# EAGLE schematic Placa_Power_ESP_sch (EAGLE 9.7.0)
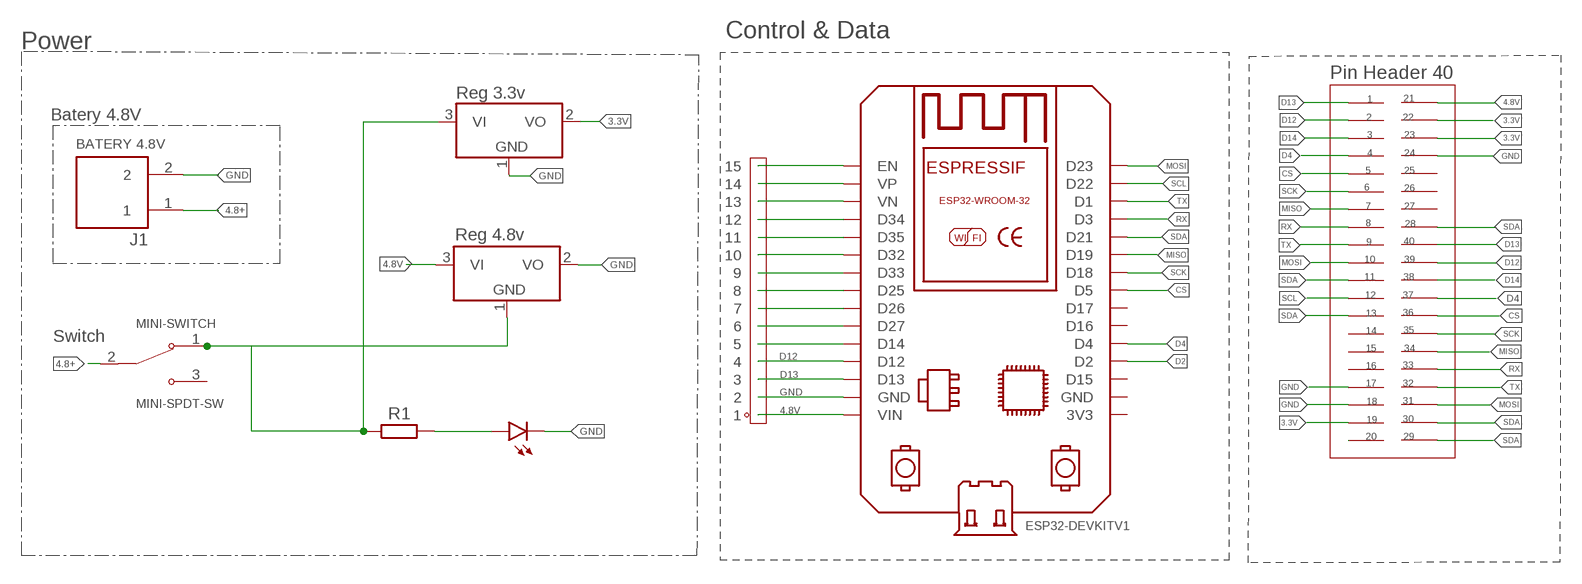
[diagram p0: schematic, sheet 1]

## Parts
D1  LED  LED_RADIALYELLOW  [LEDRD254W60D565H860B_Y]
ESP32DEVKIT  ESP32DEVKITV1SHRIDATTDUDHAT  [ESP32-DEVKITV1]
IC2  LM7805-5V  LD1117_TO220  [TO220V]
J1  BATERY 4.8V  KF301-2P  [HANDSON_KF301-2P]
LM1117-3.3V  LM1117-3.3  LD1117_TO220  [TO220V]
MINI-SWITCH  MINI-SPDT-SW  [SW_MINI-SPDT-SW-BACKUP]
R1  R_AXIAL-7.2MM-PITCH  [RESAD724W46L381D178B]
U$1  PIN_1X15  [PIN_1X15]
U$3  PINHEADER  [PINHEADER]

## Nets
3.3V: LM1117-3.3V.2(VO) U$3.19 U$3.22 U$3.23
4.8+: J1.1 MINI-SWITCH.2
4.8V: ESP32DEVKIT.VIN IC2.3(VI) U$1.1 U$3.20 U$3.21
CS: ESP32DEVKIT.D5 U$3.5 U$3.36
D2: ESP32DEVKIT.D2
D4: ESP32DEVKIT.D4 U$3.4 U$3.37
D12: ESP32DEVKIT.D12 U$1.4 U$3.2 U$3.39
D13: ESP32DEVKIT.D13 U$1.3 U$3.1 U$3.40
D14: ESP32DEVKIT.D14 U$1.5 U$3.3 U$3.38
GND: D1.C ESP32DEVKIT.GND IC2.2(VO) J1.2 LM1117-3.3V.1(GND) U$1.2 U$3.17 U$3.18 U$3.24
MISO: ESP32DEVKIT.D19 U$3.7 U$3.34
MOSI: ESP32DEVKIT.D23 U$3.10 U$3.31
N$2: D1.A R1.2
N$3: ESP32DEVKIT.EN U$1.15
N$4: ESP32DEVKIT.VP U$1.14
N$5: ESP32DEVKIT.VN U$1.13
N$6: ESP32DEVKIT.D34 U$1.12
N$7: ESP32DEVKIT.D35 U$1.11
N$8: ESP32DEVKIT.D32 U$1.10
N$9: ESP32DEVKIT.D33 U$1.9
N$10: ESP32DEVKIT.D25 U$1.8
N$11: ESP32DEVKIT.D26 U$1.7
N$12: ESP32DEVKIT.D27 U$1.6
N$13: IC2.1(GND) LM1117-3.3V.3(VI) MINI-SWITCH.1 R1.1
RX: ESP32DEVKIT.D3 U$3.8 U$3.33
SCK: ESP32DEVKIT.D18 U$3.6 U$3.35
SCL: ESP32DEVKIT.D22 U$3.12
SDA: ESP32DEVKIT.D21 U$3.11 U$3.13 U$3.28 U$3.29 U$3.30
TX: ESP32DEVKIT.D1 U$3.9 U$3.32
Unconnected: ESP32DEVKIT.3V3 ESP32DEVKIT.D15 ESP32DEVKIT.D16 ESP32DEVKIT.D17 ESP32DEVKIT.GND@1(GND) MINI-SWITCH.3 U$3.14 U$3.15 U$3.16 U$3.25 U$3.26 U$3.27

## Notes on the sheet
- Control & Data
- Power
- Pin Header 40
- Reg 3.3v | 21
- 1
- Batery 4.8V | 2 | 22
- 3 | 23
- 4 | 24
- 5 | 25
- 6 | 26
- 7 | 27
- 8 | 28
- Reg 4.8v
- 9 | 40
- 10 | 39
- 11 | 38
- 12 | 37
- 13 | 36
- 14 | 35
- Switch
- 15 | 34
- 16 | 33
- 17 | 32
- 18 | 31
- 19 | 30
- 20 | 29

## Library data of the parts
D1 = Opto-Electronic:LED_RADIAL: LED - Generic
ESP32DEVKIT = ESP32-DEVKITV1:ESP32DEVKITV1: https://github.com/shridattdudhat
IC2 LM1117-3.3V = IC_Power-Management:LD1117: Adjustable and fixed positive voltage regulator Reference Datasheet <https://www.st.com/content/ccc/resource/technical/document/datasheet/99/3b/7d/91/91/51/4b/be/CD00000544.pdf/files/CD00000544.pdf/jcr:content/translations/en.CD00000544.pdf>; CATEGORY: IC_Linear; DESCRIPTION: Adjustable voltage regulator; MANUFACTURER: STMicroelectronics; MPN: Generic; SERIES: LM1117; SUB-CATEGORY: Voltage Regulator; TYPE: Linear
J1 = KF301-2P:KF301-2P: 2 Pin Terminal Block 5mm Pitch Check availability <https://pricing.snapeda.com/parts/KF301-2P/Handson%20Technology/view-part?ref=eda>; AVAILABILITY: Not in stock; CHECK_PRICES: https://www.snapeda.com/parts/KF301-2P/Handson+Technology/view-part/?ref=eda; DESCRIPTION: 2 Pin Terminal Block 5mm Pitch; MF: Handson Technology; MP: KF301-2P; PACKAGE: None; PRICE: None; SNAPEDA_LINK: https://www.snapeda.com/parts/KF301-2P/Handson+Technology/view-part/?ref=snap
MINI-SWITCH = MINI-SPDT-SW:MINI-SPDT-SW: Simple breadboard friendly SPDT slide switch. Rated at 30V/200mA with operating force of 250 +/-100gf. Check availability <https://pricing.snapeda.com/parts/MINI-SPDT-SW/Gravitech/view-part?ref=eda>
R1 = Resistor:R: Resistor Fixed - Generic; CATEGORY: Resistor; SUB-CATEGORY: Fixed
U$1 = PIN_1X15:PIN_1X15
U$3 = PINHEADER-40:PINHEADER

## Module WF
Ports: 

### Library data of the parts